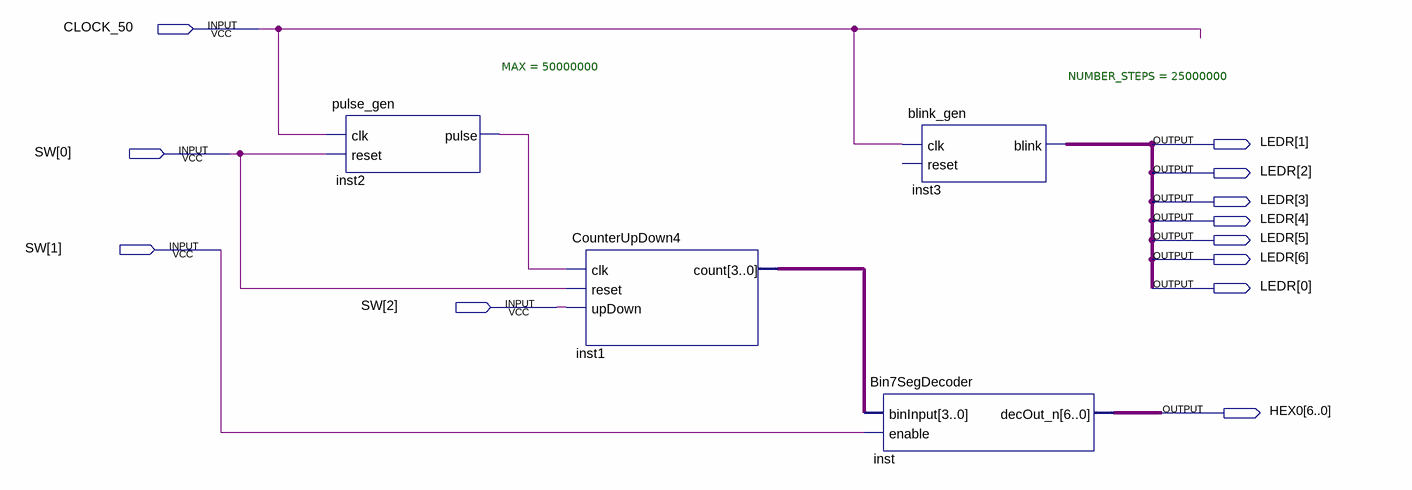
[diagram p0: schematic sheet]
// Quartus schematic anopassado.bdf as structural Verilog: 4 symbols, 12 pins
module anopassado (
  input  CLOCK_50,
  input  [2:0] SW,
  output [6:0] LEDR,
  output [6:0] HEX0
);

  wire inst2_pulse;
  wire [3:0] inst1_count;

  pulse_gen #(.MAX(50000000)) inst2 (.clk(CLOCK_50), .reset(SW[0]), .pulse(inst2_pulse));
  CounterUpDown4 inst1 (.clk(inst2_pulse), .reset(SW[0]), .upDown(SW[2]), .count(inst1_count));
  blink_gen #(.NUMBER_STEPS(25000000)) inst3 (.clk(CLOCK_50), .blink(LEDR[6]));  // open: reset
  Bin7SegDecoder inst (.binInput(inst1_count), .enable(SW[1]), .decOut_n(HEX0));

  assign LEDR[5:0] = {6{LEDR[6]}};
endmodule
